# Altium schematic sheet LPDDR4X_Ground.SchDoc
size A4; SheetNumber: 12; SheetTotal: 32
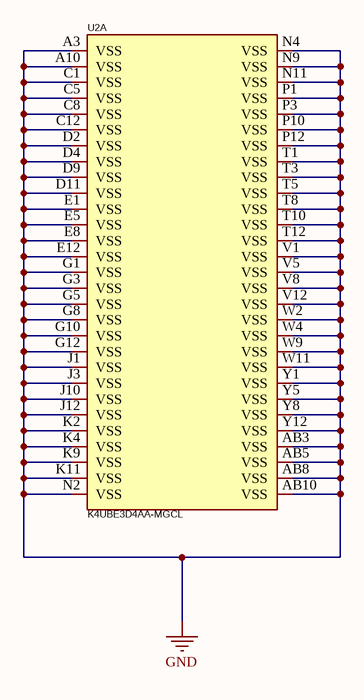
[diagram p0: LPDDR4X_Ground.SchDoc]

## Parts
U2  K4UBE3D4AA-MGCL  [K4F8E304HB-MGCJ]  (part A of 5)

## Nets
GND: U2.A3(VSS) U2.A10(VSS) U2.AB3(VSS) U2.AB5(VSS) U2.AB8(VSS) U2.AB10(VSS) U2.C1(VSS) U2.C5(VSS) U2.C8(VSS) U2.C12(VSS) U2.D2(VSS) U2.D4(VSS) U2.D9(VSS) U2.D11(VSS) U2.E1(VSS) U2.E5(VSS) U2.E8(VSS) U2.E12(VSS) U2.G1(VSS) U2.G3(VSS) U2.G5(VSS) U2.G8(VSS) U2.G10(VSS) U2.G12(VSS) U2.J1(VSS) U2.J3(VSS) U2.J10(VSS) U2.J12(VSS) U2.K2(VSS) U2.K4(VSS) U2.K9(VSS) U2.K11(VSS) U2.N2(VSS) U2.N4(VSS) U2.N9(VSS) U2.N11(VSS) U2.P1(VSS) U2.P3(VSS) U2.P10(VSS) U2.P12(VSS) U2.T1(VSS) U2.T3(VSS) U2.T5(VSS) U2.T8(VSS) U2.T10(VSS) U2.T12(VSS) U2.V1(VSS) U2.V5(VSS) U2.V8(VSS) U2.V12(VSS) U2.W2(VSS) U2.W4(VSS) U2.W9(VSS) U2.W11(VSS) U2.Y1(VSS) U2.Y5(VSS) U2.Y8(VSS) U2.Y12(VSS)

## Library data of the parts
U2 = K4UBE3D4AA-MGCL: Manufacturer: SAMSUNG(三星半导体); Add into BOM: yes; Memory Format: SDRAM LPDDR4X; Clock Frequency (fc): 2133MHz; Memory Size: 32Gbit; Supply Voltage: 1.7V~1.95V; Symbol: K4UBE3D4AA-MGCL; Device: K4UBE3D4AA-MGCL; LCSC Part Name: K4UBE3D4AA-MGCL 停产; Supplier Part: C2920257; Manufacturer Part: K4UBE3D4AA-MGCL; Supplier Footprint: FBGA-200; JLCPCB Part Class: Extended Part; Datasheet: https://atta.szlcsc.com/upload/public/pdf/source/20231024/5530CB18C2033A14DEC9B3A35E728586.pdf; Supplier: LCSC; Convert to PCB: yes; Supply current: -; Refresh Current: -; Operating Temperature: -25℃~+85℃